# Altium schematic sheet Header.SchDoc
size A4
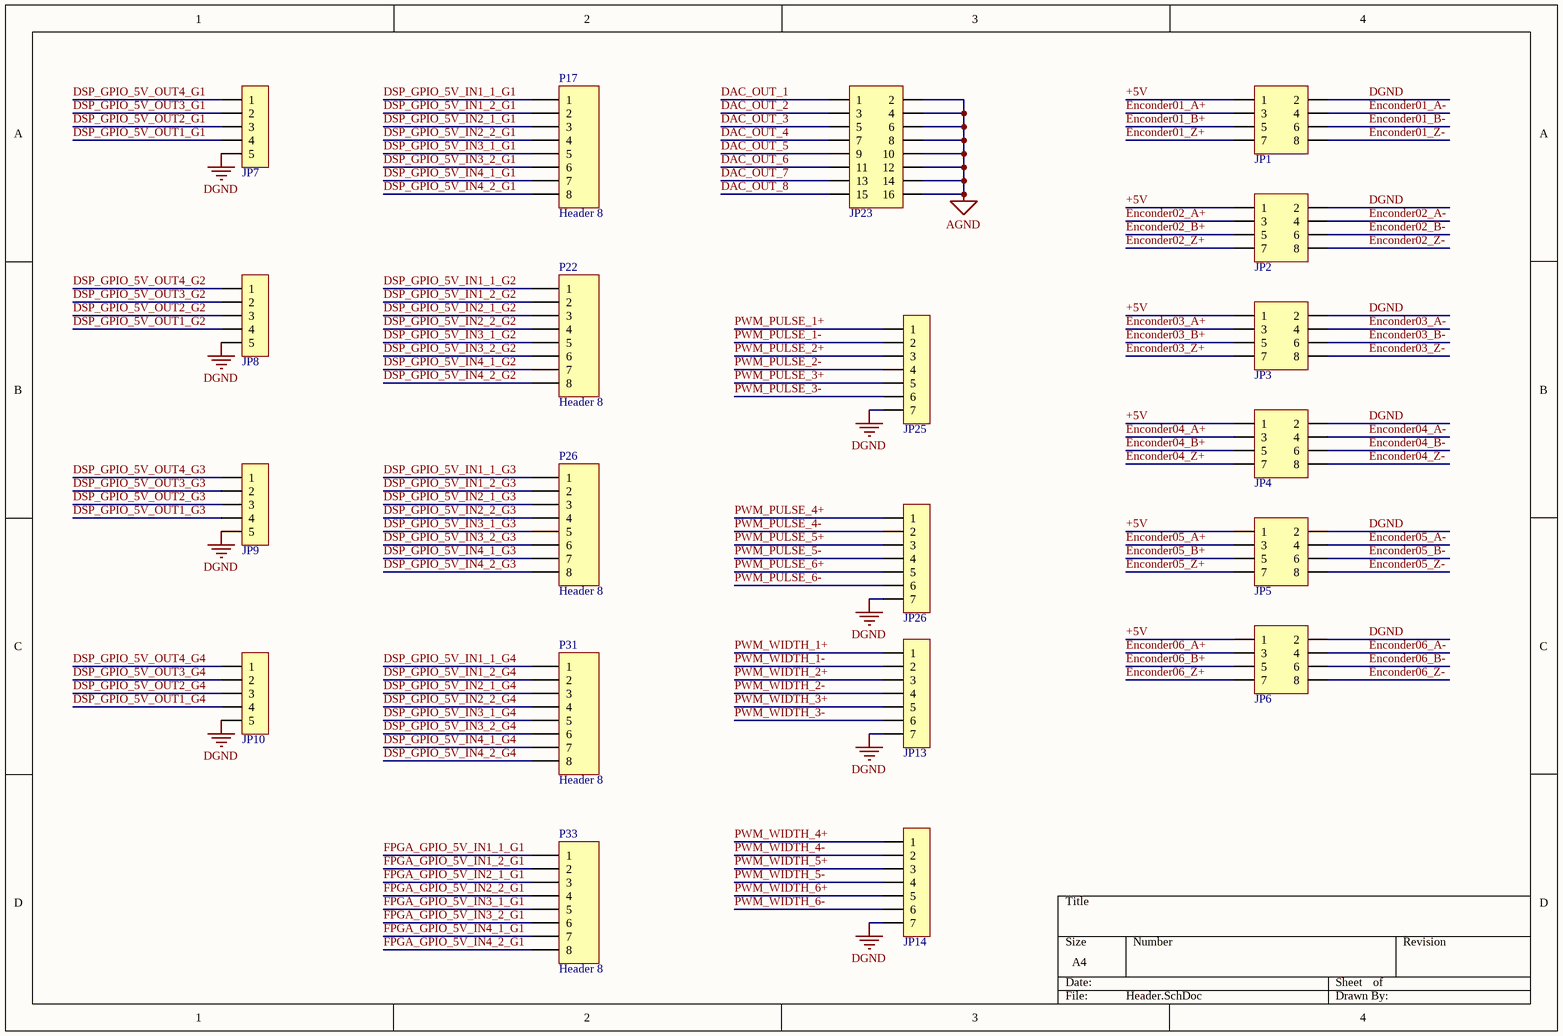
[diagram p0: Header.SchDoc]

## Parts
JP1  Header 4X2  [connector5569R]  (value not drawn)
JP2  Header 4X2  [connector5569R]  (value not drawn)
JP3  Header 4X2  [connector5569R]  (value not drawn)
JP4  Header 4X2  [connector5569R]  (value not drawn)
JP5  Header 4X2  [connector5569R]  (value not drawn)
JP6  Header 4X2  [connector5569R]  (value not drawn)
JP7  HDR-1X5  [ZH1.5-WI-5P]  (value not drawn)
JP8  HDR-1X5  [ZH1.5-WI-5P]  (value not drawn)
JP9  HDR-1X5  [ZH1.5-WI-5P]  (value not drawn)
JP10  HDR-1X5  [ZH1.5-WI-5P]  (value not drawn)
JP13  HDR-1X7  [XH2.54-WI-7P]  (value not drawn)
JP14  HDR-1X7  [XH2.54-WI-7P]  (value not drawn)
JP23  Header 8X2  [connector558916pin]  (value not drawn)
JP25  HDR-1X7  [XH2.54-WI-7P]  (value not drawn)
JP26  HDR-1X7  [XH2.54-WI-7P]  (value not drawn)
P17  Header 8  [connector5569R]
P22  Header 8  [connector5569R]
P26  Header 8  [connector5569R]
P31  Header 8  [connector5569R]
P33  Header 8  [connector5569R]

## Nets
AGND: JP23.2 JP23.4 JP23.6 JP23.8 JP23.10 JP23.12 JP23.14 JP23.16
DGND: JP1.2 JP2.2 JP3.2 JP4.2 JP5.2 JP6.2 JP7.5 JP8.5 JP9.5 JP10.5 JP13.7 JP14.7 JP25.7 JP26.7
+5V: JP1.1 JP2.1 JP3.1 JP4.1 JP5.1 JP6.1
DAC_OUT_1: JP23.1
DAC_OUT_2: JP23.3
DAC_OUT_3: JP23.5
DAC_OUT_4: JP23.7
DAC_OUT_5: JP23.9
DAC_OUT_6: JP23.11
DAC_OUT_7: JP23.13
DAC_OUT_8: JP23.15
DSP_GPIO_5V_IN1_1_G1: P17.1
DSP_GPIO_5V_IN1_1_G2: P22.1
DSP_GPIO_5V_IN1_1_G3: P26.1
DSP_GPIO_5V_IN1_1_G4: P31.1
DSP_GPIO_5V_IN1_2_G1: P17.2
DSP_GPIO_5V_IN1_2_G2: P22.2
DSP_GPIO_5V_IN1_2_G3: P26.2
DSP_GPIO_5V_IN1_2_G4: P31.2
DSP_GPIO_5V_IN2_1_G1: P17.3
DSP_GPIO_5V_IN2_1_G2: P22.3
DSP_GPIO_5V_IN2_1_G3: P26.3
DSP_GPIO_5V_IN2_1_G4: P31.3
DSP_GPIO_5V_IN2_2_G1: P17.4
DSP_GPIO_5V_IN2_2_G2: P22.4
DSP_GPIO_5V_IN2_2_G3: P26.4
DSP_GPIO_5V_IN2_2_G4: P31.4
DSP_GPIO_5V_IN3_1_G1: P17.5
DSP_GPIO_5V_IN3_1_G2: P22.5
DSP_GPIO_5V_IN3_1_G3: P26.5
DSP_GPIO_5V_IN3_1_G4: P31.5
DSP_GPIO_5V_IN3_2_G1: P17.6
DSP_GPIO_5V_IN3_2_G2: P22.6
DSP_GPIO_5V_IN3_2_G3: P26.6
DSP_GPIO_5V_IN3_2_G4: P31.6
DSP_GPIO_5V_IN4_1_G1: P17.7
DSP_GPIO_5V_IN4_1_G2: P22.7
DSP_GPIO_5V_IN4_1_G3: P26.7
DSP_GPIO_5V_IN4_1_G4: P31.7
DSP_GPIO_5V_IN4_2_G1: P17.8
DSP_GPIO_5V_IN4_2_G2: P22.8
DSP_GPIO_5V_IN4_2_G3: P26.8
DSP_GPIO_5V_IN4_2_G4: P31.8
DSP_GPIO_5V_OUT1_G1: JP7.4
DSP_GPIO_5V_OUT1_G2: JP8.4
DSP_GPIO_5V_OUT1_G3: JP9.4
DSP_GPIO_5V_OUT1_G4: JP10.4
DSP_GPIO_5V_OUT2_G1: JP7.3
DSP_GPIO_5V_OUT2_G2: JP8.3
DSP_GPIO_5V_OUT2_G3: JP9.3
DSP_GPIO_5V_OUT2_G4: JP10.3
DSP_GPIO_5V_OUT3_G1: JP7.2
DSP_GPIO_5V_OUT3_G2: JP8.2
DSP_GPIO_5V_OUT3_G3: JP9.2
DSP_GPIO_5V_OUT3_G4: JP10.2
DSP_GPIO_5V_OUT4_G1: JP7.1
DSP_GPIO_5V_OUT4_G2: JP8.1
DSP_GPIO_5V_OUT4_G3: JP9.1
DSP_GPIO_5V_OUT4_G4: JP10.1
Enconder01_A+: JP1.3
Enconder01_A-: JP1.4
Enconder01_B+: JP1.5
Enconder01_B-: JP1.6
Enconder01_Z+: JP1.7
Enconder01_Z-: JP1.8
Enconder02_A+: JP2.3
Enconder02_A-: JP2.4
Enconder02_B+: JP2.5
Enconder02_B-: JP2.6
Enconder02_Z+: JP2.7
Enconder02_Z-: JP2.8
Enconder03_A+: JP3.3
Enconder03_A-: JP3.4
Enconder03_B+: JP3.5
Enconder03_B-: JP3.6
Enconder03_Z+: JP3.7
Enconder03_Z-: JP3.8
Enconder04_A+: JP4.3
Enconder04_A-: JP4.4
Enconder04_B+: JP4.5
Enconder04_B-: JP4.6
Enconder04_Z+: JP4.7
Enconder04_Z-: JP4.8
Enconder05_A+: JP5.3
Enconder05_A-: JP5.4
Enconder05_B+: JP5.5
Enconder05_B-: JP5.6
Enconder05_Z+: JP5.7
Enconder05_Z-: JP5.8
Enconder06_A+: JP6.3
Enconder06_A-: JP6.4
Enconder06_B+: JP6.5
Enconder06_B-: JP6.6
Enconder06_Z+: JP6.7
Enconder06_Z-: JP6.8
FPGA_GPIO_5V_IN1_1_G1: P33.1
FPGA_GPIO_5V_IN1_2_G1: P33.2
FPGA_GPIO_5V_IN2_1_G1: P33.3
FPGA_GPIO_5V_IN2_2_G1: P33.4
FPGA_GPIO_5V_IN3_1_G1: P33.5
FPGA_GPIO_5V_IN3_2_G1: P33.6
FPGA_GPIO_5V_IN4_1_G1: P33.7
FPGA_GPIO_5V_IN4_2_G1: P33.8
PWM_PULSE_1+: JP25.1
PWM_PULSE_1-: JP25.2
PWM_PULSE_2+: JP25.3
PWM_PULSE_2-: JP25.4
PWM_PULSE_3+: JP25.5
PWM_PULSE_3-: JP25.6
PWM_PULSE_4+: JP26.1
PWM_PULSE_4-: JP26.2
PWM_PULSE_5+: JP26.3
PWM_PULSE_5-: JP26.4
PWM_PULSE_6+: JP26.5
PWM_PULSE_6-: JP26.6
PWM_WIDTH_1+: JP13.1
PWM_WIDTH_1-: JP13.2
PWM_WIDTH_2+: JP13.3
PWM_WIDTH_2-: JP13.4
PWM_WIDTH_3+: JP13.5
PWM_WIDTH_3-: JP13.6
PWM_WIDTH_4+: JP14.1
PWM_WIDTH_4-: JP14.2
PWM_WIDTH_5+: JP14.3
PWM_WIDTH_5-: JP14.4
PWM_WIDTH_6+: JP14.5
PWM_WIDTH_6-: JP14.6

## Library data of the parts
JP1-JP6 = Header 4X2: 4*2P接插件; 版权归属: 源创客; BOM名称: 4*2P接插件; 学习资源: www.ooocke.com
JP7-JP10 = Header 5: 5P接插件; 版权归属: 源创客; BOM名称: 5P接插件; 学习资源: www.ooocke.com
JP13 JP14 JP25 JP26 = Header 7: 7P接插件; 版权归属: 源创客; BOM名称: 7P接插件; 学习资源: www.ooocke.com
JP23 = Header 8X2: 8*2P接插件; 版权归属: 源创客; BOM名称: 8*2P接插件; 学习资源: www.ooocke.com
P17 P22 P26 P31 P33 = Header 8: Header, 8-Pin; LatestRevisionDate: 17-Jul-2002; LatestRevisionNote: Re-released for DXP Platform.; Publisher: Altium Limited